# EAGLE design durtest-ripup (EAGLE 6.0)
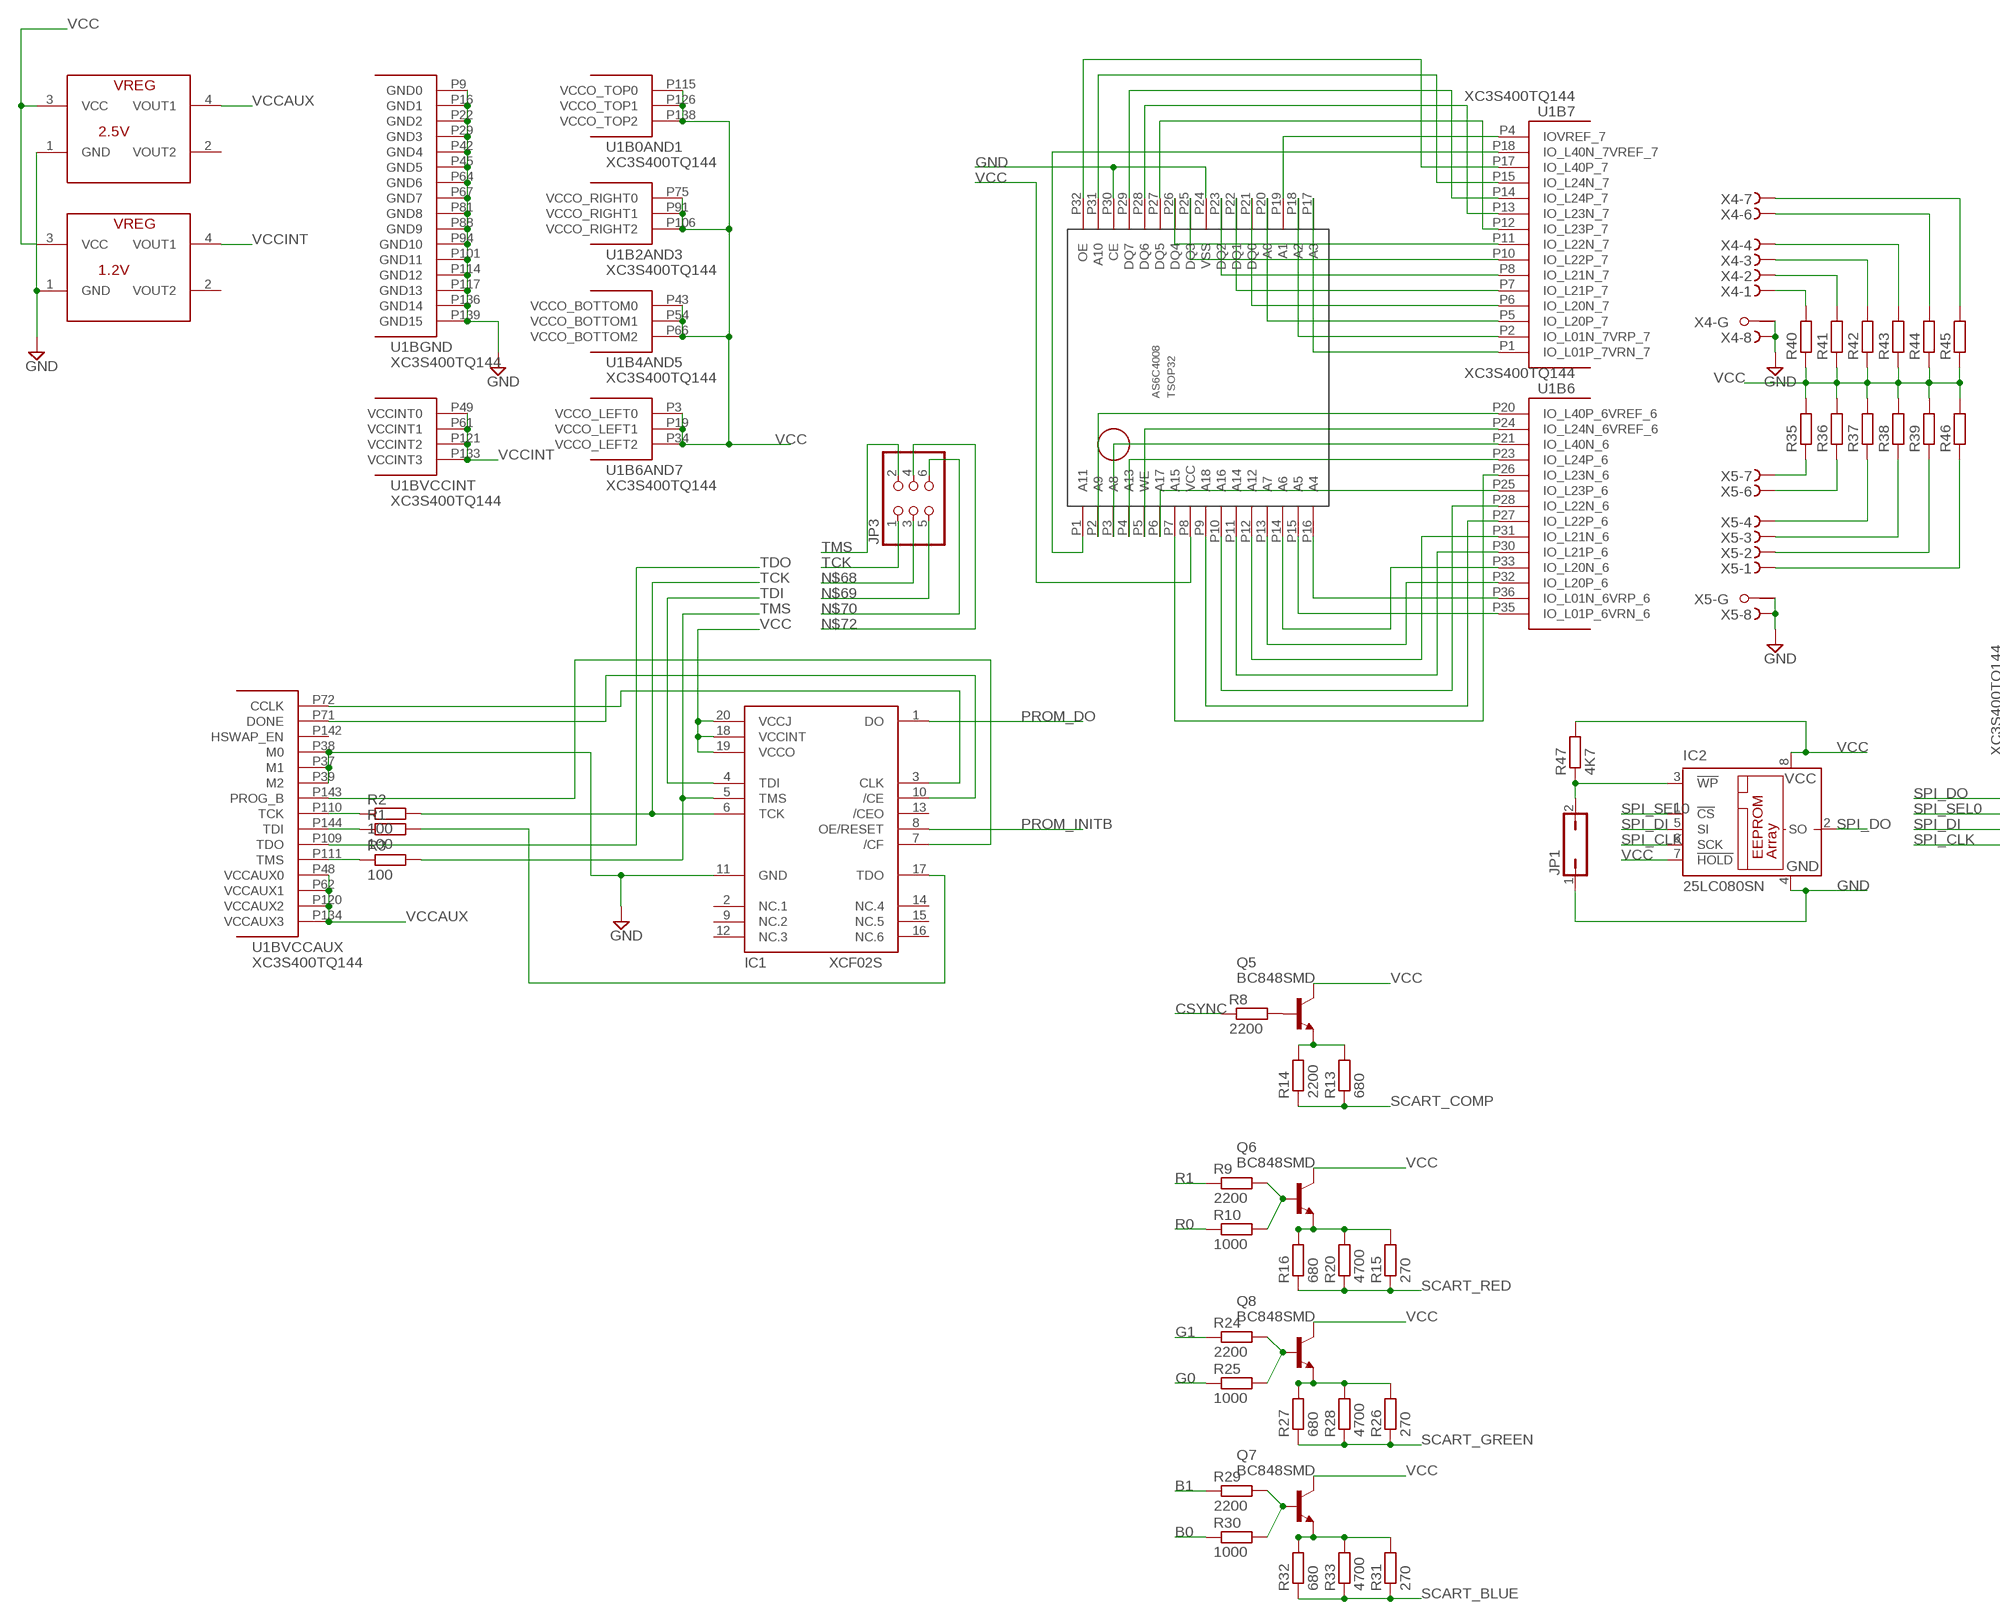
[diagram p0: schematic, sheet 1, part 1 of 2]
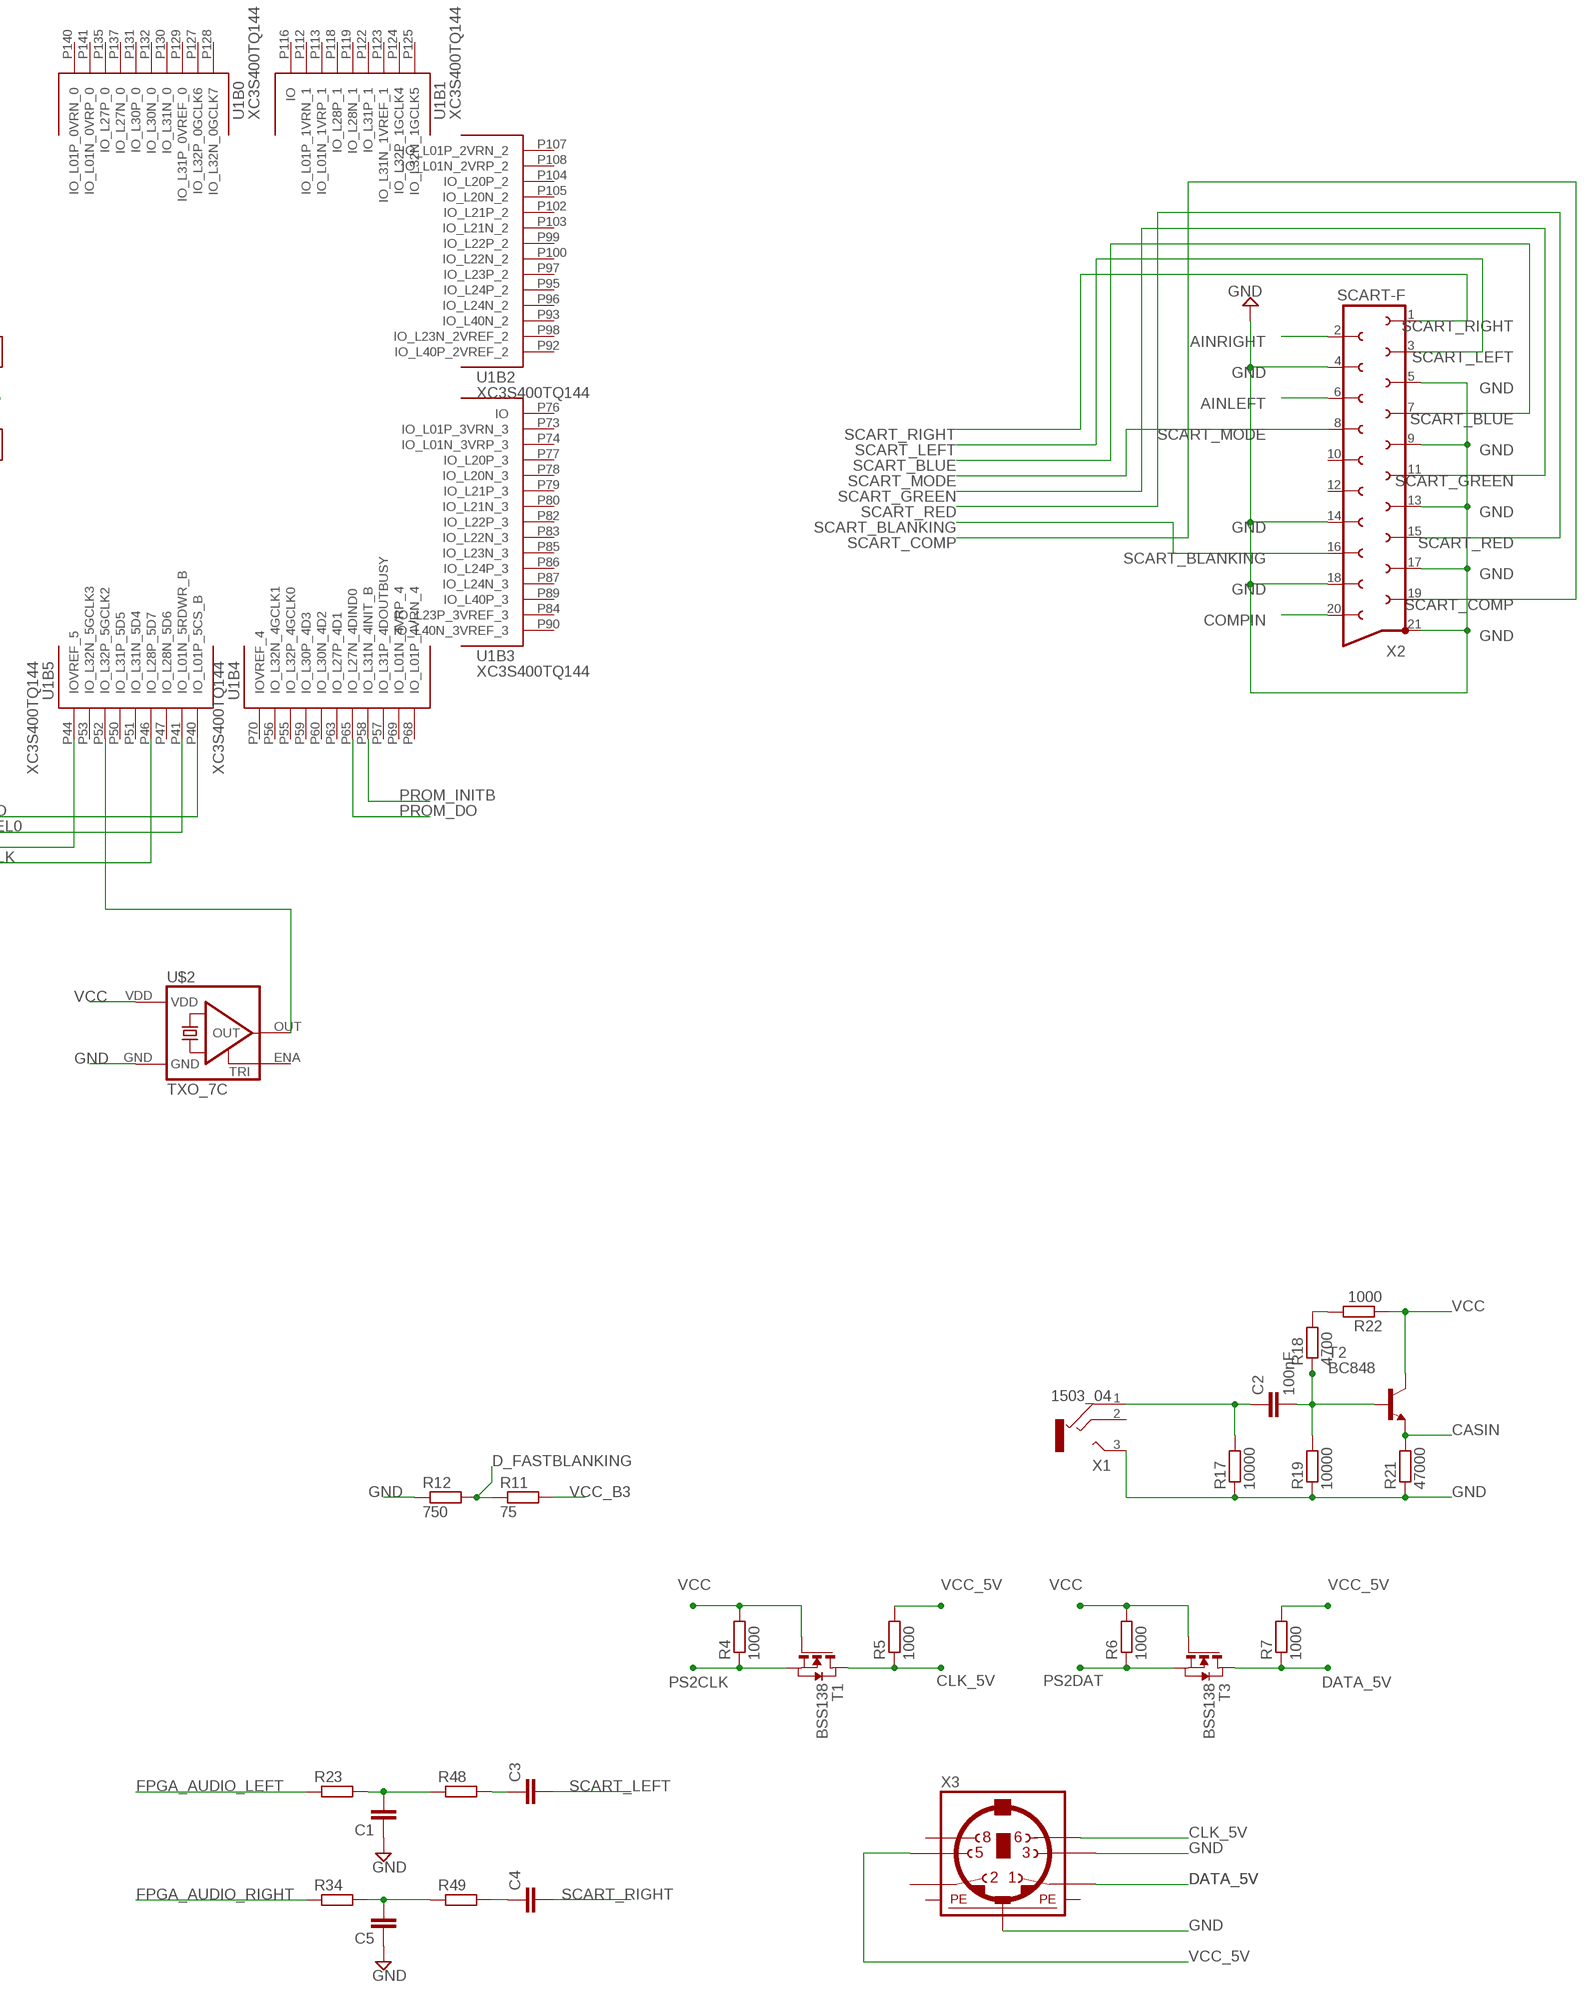
[diagram p1: schematic, sheet 1, part 2 of 2]

## Parts
C1  C-EUC0603  [C0603]
C2  100nF  C-EUC0603  [C0603]
C3  C-EUC0603  [C0603]
C4  C-EUC0603  [C0603]
C5  C-EUC0603  [C0603]
IC1  XCF02S  [VO20]
IC2  25LC080SN  [SO-08]
JP1  JP1Q  [JP1]
JP3  PINHD-2X3  [2X03]
Q5  BC848SMD  [SOT23]
Q6  BC848SMD  [SOT23]
Q7  BC848SMD  [SOT23]
Q8  BC848SMD  [SOT23]
R1  100  R-EU_R0805  [R0805]
R2  100  R-EU_R0805  [R0805]
R3  100  R-EU_R0805  [R0805]
R4  1000  R-EU_R0805  [R0805]
R5  1000  R-EU_R0805  [R0805]
R6  1000  R-EU_R0805  [R0805]
R7  1000  R-EU_R0805  [R0805]
R8  2200  R-EU_R0805  [R0805]
R9  2200  R-EU_R0805  [R0805]
R10  1000  R-EU_R0805  [R0805]
R11  75  R-EU_R0805  [R0805]
R12  750  R-EU_R0805  [R0805]
R13  680  R-EU_R0805  [R0805]
R14  2200  R-EU_R0805  [R0805]
R15  270  R-EU_R0805  [R0805]
R16  680  R-EU_R0805  [R0805]
R17  10000  R-EU_R0805  [R0805]
R18  4700  R-EU_R0805  [R0805]
R19  10000  R-EU_R0805  [R0805]
R20  4700  R-EU_R0805  [R0805]
R21  47000  R-EU_R0805  [R0805]
R22  1000  R-EU_R0805  [R0805]
R23  R-EU_M0805  [M0805]
R24  2200  R-EU_R0805  [R0805]
R25  1000  R-EU_R0805  [R0805]
R26  270  R-EU_R0805  [R0805]
R27  680  R-EU_R0805  [R0805]
R28  4700  R-EU_R0805  [R0805]
R29  2200  R-EU_R0805  [R0805]
R30  1000  R-EU_R0805  [R0805]
R31  270  R-EU_R0805  [R0805]
R32  680  R-EU_R0805  [R0805]
R33  4700  R-EU_R0805  [R0805]
R34  R-EU_M0805  [M0805]
R35  R-EU_M0805  [M0805]
R36  R-EU_M0805  [M0805]
R37  R-EU_M0805  [M0805]
R38  R-EU_M0805  [M0805]
R39  R-EU_M0805  [M0805]
R40  R-EU_M0805  [M0805]
R41  R-EU_M0805  [M0805]
R42  R-EU_M0805  [M0805]
R43  R-EU_M0805  [M0805]
R44  R-EU_M0805  [M0805]
R45  R-EU_M0805  [M0805]
R46  R-EU_M0805  [M0805]
R47  4K7  R-EU_R0805  [R0805]
R48  R-EU_M0805  [M0805]
R49  R-EU_M0805  [M0805]
REG1.2  1.2V  NX1117  [SOT223]
REG2.5  2.5V  NX1117  [SOT223]
T1  BSS138  NMOSSOT23  [SOT-23]
T2  BC848  [SOT23]
T3  BSS138  NMOSSOT23  [SOT-23]
U1  XC3S400TQ144  [TQ144]
U$1  AS6C4008  [TSOP32]
U$2  TXO_7C  [OSC_7C]
X1  1503_04  [1503_04]
X2  SCART-F  [SCART-F]
X3  MINI_DIN_6  [M_DIN6]
X4  F09HPS  [F09HP]
X5  F09HPS  [F09HP]

## Nets
AINLEFT: X2.6
AINRIGHT: X2.2
B0: R30.1
B1: R29.1
CASIN: R21.2 T2.2(E)
CLK_5V: R5.1 T1.1(D) X3.6
COMPIN: X2.20
CSYNC: R8.1
D_FASTBLANKING: R11.1 R12.2
DATA_5V: R7.1 T3.1(D) X3.1
FPGA_AUDIO_LEFT: R23.1
FPGA_AUDIO_RIGHT: R34.1
G0: R25.1
G1: R24.1
GND: C1.1 C5.1 IC1.11(GND) IC2.4(GND) JP1.1 R12.1 R17.1 R19.1 R21.1 REG1.2.1(GND) REG2.5.1(GND) U1.P9(BGND:GND0) U1.P16(BGND:GND1) U1.P22(BGND:GND2) U1.P29(BGND:GND3) U1.P37(BVCCAUX:M1) U1.P38(BVCCAUX:M0) U1.P39(BVCCAUX:M2) U1.P42(BGND:GND4) U1.P45(BGND:GND5) U1.P64(BGND:GND6) U1.P67(BGND:GND7) U1.P81(BGND:GND8) U1.P88(BGND:GND9) U1.P94(BGND:GND10) U1.P101(BGND:GND11) U1.P114(BGND:GND12) U1.P117(BGND:GND13) U1.P136(BGND:GND14) U1.P139(BGND:GND15) U$1.P24(VSS) U$1.P30(CE) U$2.GND X1.3 X2.4 X2.5 X2.9 X2.13 X2.14 X2.17 X2.18 X2.21 X3.3 X3.SH2(PE2) X4.8(-8:F) X4.G1(-G:G1) X5.8(-8:F) X5.G1(-G:G1)
N$1: U1.P1(B7:IO_L01P_7VRN_7) U$1.P17(A3)
N$2: U1.P2(B7:IO_L01N_7VRP_7) U$1.P18(A2)
N$3: U1.P4(B7:IOVREF_7) U$1.P19(A1)
N$4: U1.P5(B7:IO_L20P_7) U$1.P20(A0)
N$5: U1.P6(B7:IO_L20N_7) U$1.P21(DQ0)
N$6: U1.P7(B7:IO_L21P_7) U$1.P22(DQ1)
N$7: U1.P8(B7:IO_L21N_7) U$1.P23(DQ2)
N$8: U1.P10(B7:IO_L22P_7) U$1.P25(DQ3)
N$9: U1.P11(B7:IO_L22N_7) U$1.P26(DQ4)
N$10: U1.P12(B7:IO_L23P_7) U$1.P27(DQ5)
N$11: U1.P13(B7:IO_L23N_7) U$1.P28(DQ6)
N$12: U1.P14(B7:IO_L24P_7) U$1.P29(DQ7)
N$13: U1.P15(B7:IO_L24N_7) U$1.P31(A10)
N$14: U1.P17(B7:IO_L40P_7) U$1.P32(OE)
N$15: U1.P18(B7:IO_L40N_7VREF_7) U$1.P1(A11)
N$16: U1.P20(B6:IO_L40P_6VREF_6) U$1.P2(A9)
N$17: U1.P21(B6:IO_L40N_6) U$1.P3(A8)
N$18: U1.P23(B6:IO_L24P_6) U$1.P4(A13)
N$19: U1.P24(B6:IO_L24N_6VREF_6) U$1.P5(WE)
N$20: U1.P25(B6:IO_L23P_6) U$1.P6(A17)
N$21: U1.P26(B6:IO_L23N_6) U$1.P7(A15)
N$22: U1.P27(B6:IO_L22P_6) U$1.P9(A18)
N$23: U1.P28(B6:IO_L22N_6) U$1.P10(A16)
N$24: U1.P30(B6:IO_L21P_6) U$1.P11(A14)
N$25: U1.P31(B6:IO_L21N_6) U$1.P12(A12)
N$26: U1.P32(B6:IO_L20P_6) U$1.P13(A7)
N$27: U1.P33(B6:IO_L20N_6) U$1.P14(A6)
N$28: U1.P35(B6:IO_L01P_6VRN_6) U$1.P15(A5)
N$29: U1.P36(B6:IO_L01N_6VRP_6) U$1.P16(A4)
N$30: R35.1 X5.7(-7:F)
N$31: R36.1 X5.6(-6:F)
N$32: R37.1 X5.4(-4:F)
N$33: R38.1 X5.3(-3:F)
N$34: R39.1 X5.2(-2:F)
N$35: IC1.3(CLK) U1.P72(BVCCAUX:CCLK)
N$36: IC1.17(TDO) R1.2
N$37: R46.1 X5.1(-1:F)
N$38: IC1.10(/CE) U1.P71(BVCCAUX:DONE)
N$39: R2.1 U1.P110(BVCCAUX:TCK)
N$40: IC1.7(/CF) U1.P143(BVCCAUX:PROG_B)
N$41: R40.2 X4.1(-1:F)
N$42: R1.1 U1.P144(BVCCAUX:TDI)
N$43: R3.1 U1.P111(BVCCAUX:TMS)
N$44: R41.2 X4.2(-2:F)
N$45: R42.2 X4.3(-3:F)
N$46: R43.2 X4.4(-4:F)
N$47: R44.2 X4.6(-6:F)
N$48: R45.2 X4.7(-7:F)
N$49: IC2.3(!WP) JP1.2 R47.1
N$50: U1.P52(B5:IO_L32P_5GCLK2) U$2.OUT
N$51: C1.2 R23.2 R48.1
N$52: C3.1 R48.2
N$53: Q6.1(B) R9.2 R10.2
N$54: Q6.2(E) R15.2 R16.2 R20.2
N$55: Q8.1(B) R24.2 R25.2
N$56: Q8.2(E) R26.2 R27.2 R28.2
N$57: Q7.1(B) R29.2 R30.2
N$58: Q7.2(E) R31.2 R32.2 R33.2
N$59: Q5.2(E) R13.2 R14.2
N$60: C2.2 R18.1 R19.2 T2.1(B)
N$61: C2.1 R17.2 X1.1
N$62: R18.2 R22.2
N$63: Q5.1(B) R8.2
N$64: C4.1 R49.2
N$65: C5.2 R34.2 R49.1
N$68: JP3.3
N$69: JP3.5
N$70: JP3.6
N$72: JP3.4
PROM_DO: IC1.1(DO) U1.P65(B4:IO_L27N_4DIND0)
PROM_INITB: IC1.8(OE/RESET) U1.P58(B4:IO_L31N_4INIT_B)
PS2CLK: R4.1 T1.2(S)
PS2DAT: R6.1 T3.2(S)
R0: R10.1
R1: R9.1
SCART_BLANKING: X2.16
SCART_BLUE: R31.1 R32.1 R33.1 X2.7
SCART_COMP: R13.1 R14.1 X2.19
SCART_GREEN: R26.1 R27.1 R28.1 X2.11
SCART_LEFT: C3.2 X2.3
SCART_MODE: X2.8
SCART_RED: R15.1 R16.1 R20.1 X2.15
SCART_RIGHT: C4.2 X2.1
SPI_CLK: IC2.6(SCK) U1.P46(B5:IO_L28P_5D7)
SPI_DI: IC2.5(SI) U1.P44(B5:IOVREF_5)
SPI_DO: IC2.2(SO) U1.P40(B5:IO_L01P_5CS_B)
SPI_SEL0: IC2.1(!CS) U1.P41(B5:IO_L01N_5RDWR_B)
TCK: IC1.6(TCK) JP3.1 R2.2
TDI: IC1.4(TDI)
TDO: U1.P109(BVCCAUX:TDO)
TMS: IC1.5(TMS) JP3.2 R3.2
VCC: IC1.18(VCCINT) IC1.19(VCCO) IC1.20(VCCJ) IC2.7(!HOLD) IC2.8(VCC) Q5.3(C) Q6.3(C) Q7.3(C) Q8.3(C) R4.2 R6.2 R22.1 R35.2 R36.2 R37.2 R38.2 R39.2 R40.1 R41.1 R42.1 R43.1 R44.1 R45.1 R46.2 R47.2 REG1.2.3(VCC) REG2.5.3(VCC) T1.3(G) T2.3(C) T3.3(G) U1.P3(B6AND7:VCCO_LEFT0) U1.P19(B6AND7:VCCO_LEFT1) U1.P34(B6AND7:VCCO_LEFT2) U1.P43(B4AND5:VCCO_BOTTOM0) U1.P54(B4AND5:VCCO_BOTTOM1) U1.P66(B4AND5:VCCO_BOTTOM2) U1.P75(B2AND3:VCCO_RIGHT0) U1.P91(B2AND3:VCCO_RIGHT1) U1.P106(B2AND3:VCCO_RIGHT2) U1.P115(B0AND1:VCCO_TOP0) U1.P126(B0AND1:VCCO_TOP1) U1.P138(B0AND1:VCCO_TOP2) U$1.P8(VCC) U$2.VDD
VCC_5V: R5.2 R7.2 X3.5
VCC_B3: R11.2
VCCAUX: REG2.5.4(VOUT1) U1.P48(BVCCAUX:VCCAUX0) U1.P62(BVCCAUX:VCCAUX1) U1.P120(BVCCAUX:VCCAUX2) U1.P134(BVCCAUX:VCCAUX3)
VCCINT: REG1.2.4(VOUT1) U1.P49(BVCCINT:VCCINT0) U1.P61(BVCCINT:VCCINT1) U1.P121(BVCCINT:VCCINT2) U1.P133(BVCCINT:VCCINT3)
Unconnected: IC1.2(NC.1) IC1.9(NC.2) IC1.12(NC.3) IC1.13(/CEO) IC1.14(NC.4) IC1.15(NC.5) IC1.16(NC.6) REG1.2.2(VOUT2) REG2.5.2(VOUT2) U1.P47(B5:IO_L28N_5D6) U1.P50(B5:IO_L31P_5D5) U1.P51(B5:IO_L31N_5D4) U1.P53(B5:IO_L32N_5GCLK3) U1.P55(B4:IO_L32P_4GCLK0) U1.P56(B4:IO_L32N_4GCLK1) U1.P57(B4:IO_L31P_4DOUTBUSY) U1.P59(B4:IO_L30P_4D3) U1.P60(B4:IO_L30N_4D2) U1.P63(B4:IO_L27P_4D1) U1.P68(B4:IO_L01P_4VRN_4) U1.P69(B4:IO_L01N_4VRP_4) U1.P70(B4:IOVREF_4) U1.P73(B3:IO_L01P_3VRN_3) U1.P74(B3:IO_L01N_3VRP_3) U1.P76(B3:IO) U1.P77(B3:IO_L20P_3) U1.P78(B3:IO_L20N_3) U1.P79(B3:IO_L21P_3) U1.P80(B3:IO_L21N_3) U1.P82(B3:IO_L22P_3) U1.P83(B3:IO_L22N_3) U1.P84(B3:IO_L23P_3VREF_3) U1.P85(B3:IO_L23N_3) U1.P86(B3:IO_L24P_3) U1.P87(B3:IO_L24N_3) U1.P89(B3:IO_L40P_3) U1.P90(B3:IO_L40N_3VREF_3) U1.P92(B2:IO_L40P_2VREF_2) U1.P93(B2:IO_L40N_2) U1.P95(B2:IO_L24P_2) U1.P96(B2:IO_L24N_2) U1.P97(B2:IO_L23P_2) U1.P98(B2:IO_L23N_2VREF_2) U1.P99(B2:IO_L22P_2) U1.P100(B2:IO_L22N_2) U1.P102(B2:IO_L21P_2) U1.P103(B2:IO_L21N_2) U1.P104(B2:IO_L20P_2) U1.P105(B2:IO_L20N_2) U1.P107(B2:IO_L01P_2VRN_2) U1.P108(B2:IO_L01N_2VRP_2) U1.P112(B1:IO_L01P_1VRN_1) U1.P113(B1:IO_L01N_1VRP_1) U1.P116(B1:IO) U1.P118(B1:IO_L28P_1) U1.P119(B1:IO_L28N_1) U1.P122(B1:IO_L31P_1) U1.P123(B1:IO_L31N_1VREF_1) U1.P124(B1:IO_L32P_1GCLK4) U1.P125(B1:IO_L32N_1GCLK5) U1.P127(B0:IO_L32P_0GCLK6) U1.P128(B0:IO_L32N_0GCLK7) U1.P129(B0:IO_L31P_0VREF_0) U1.P130(B0:IO_L31N_0) U1.P131(B0:IO_L30P_0) U1.P132(B0:IO_L30N_0) U1.P135(B0:IO_L27P_0) U1.P137(B0:IO_L27N_0) U1.P140(B0:IO_L01P_0VRN_0) U1.P141(B0:IO_L01N_0VRP_0) U1.P142(BVCCAUX:HSWAP_EN) U$2.ENA(TRI) X1.2 X2.10 X2.12 X3.2 X3.8 X4.5(-5:F) X4.9(-9:F) X4.G2(-G:G2) X5.5(-5:F) X5.9(-9:F) X5.G2(-G:G2)

## Power pins joined to a net without a drawn wire
PE1: X3.SH1(PE1)
PE3: X3.SH3(PE3)

## Library data of the parts
C1-C5 = resistor:C-EU: CAPACITOR, European symbol
IC1 = smd-special:XCF02S
IC2 = microchip:25*: Serial EEPROM 4K/ 8K , SPI bus; MF: MICROCHIP; MPN: 25LC080/SN; OC_FARNELL: 1137302; OC_NEWARK: 96K4092
JP1 = jumper:JP1Q: JUMPER
JP3 = pinhead:PINHD-2X3: PIN HEADER
Q5-Q8 = bc548:BC848*: NPN Transistor
R1-R22 R24-R33 R47 = rcl:R-EU_: RESISTOR, European symbol
R23 R34-R46 R48 R49 = resistor:R-EU_: RESISTOR, European symbol
REG1.2 REG2.5 = cpcfpga:NX1117
T1 T3 = zetex:NMOSSOT23: MOS FET; OC_FARNELL: unknown; OC_NEWARK: unknown
T2 = transistor:BC848: NPN TRANSISTOR
U1 = xilinx_spartan3_virtex4_and_5:XC3S400TQ144: Xilinx FPGA
U$1 = cpcfpga:AS6C4008
U$2 = cpcfpga:TXO_7C: TXC crystal oscillator http://www.txccrystal.com/images/pdf/7c.pdf
X1 = con-lumberg:1503_04: Jack connectors according to JISC 6560, 3.5 mm, IP 57 Klinkensteckverbinder nach JISC 6560, 3,5 mm, IP 57 Source: http://www.lumberg.com/Produkte/PDFs/1503_04.pdf; OC_FARNELL: 1216981; OC_NEWARK: unknown
X2 = con-hirschmann:SCART-F: TV SCART CONNECTOR; OC_FARNELL: unknown; OC_NEWARK: unknown
X3 = mini_din:MINI_DIN_6
X4 X5 = con-subd:F09HPS: SUB-D; OC_FARNELL: unknown; OC_NEWARK: unknown

## Net classes
1 power: width 0.6 mm, drill 1.1 mm, clearance 0.4 mm

## Board
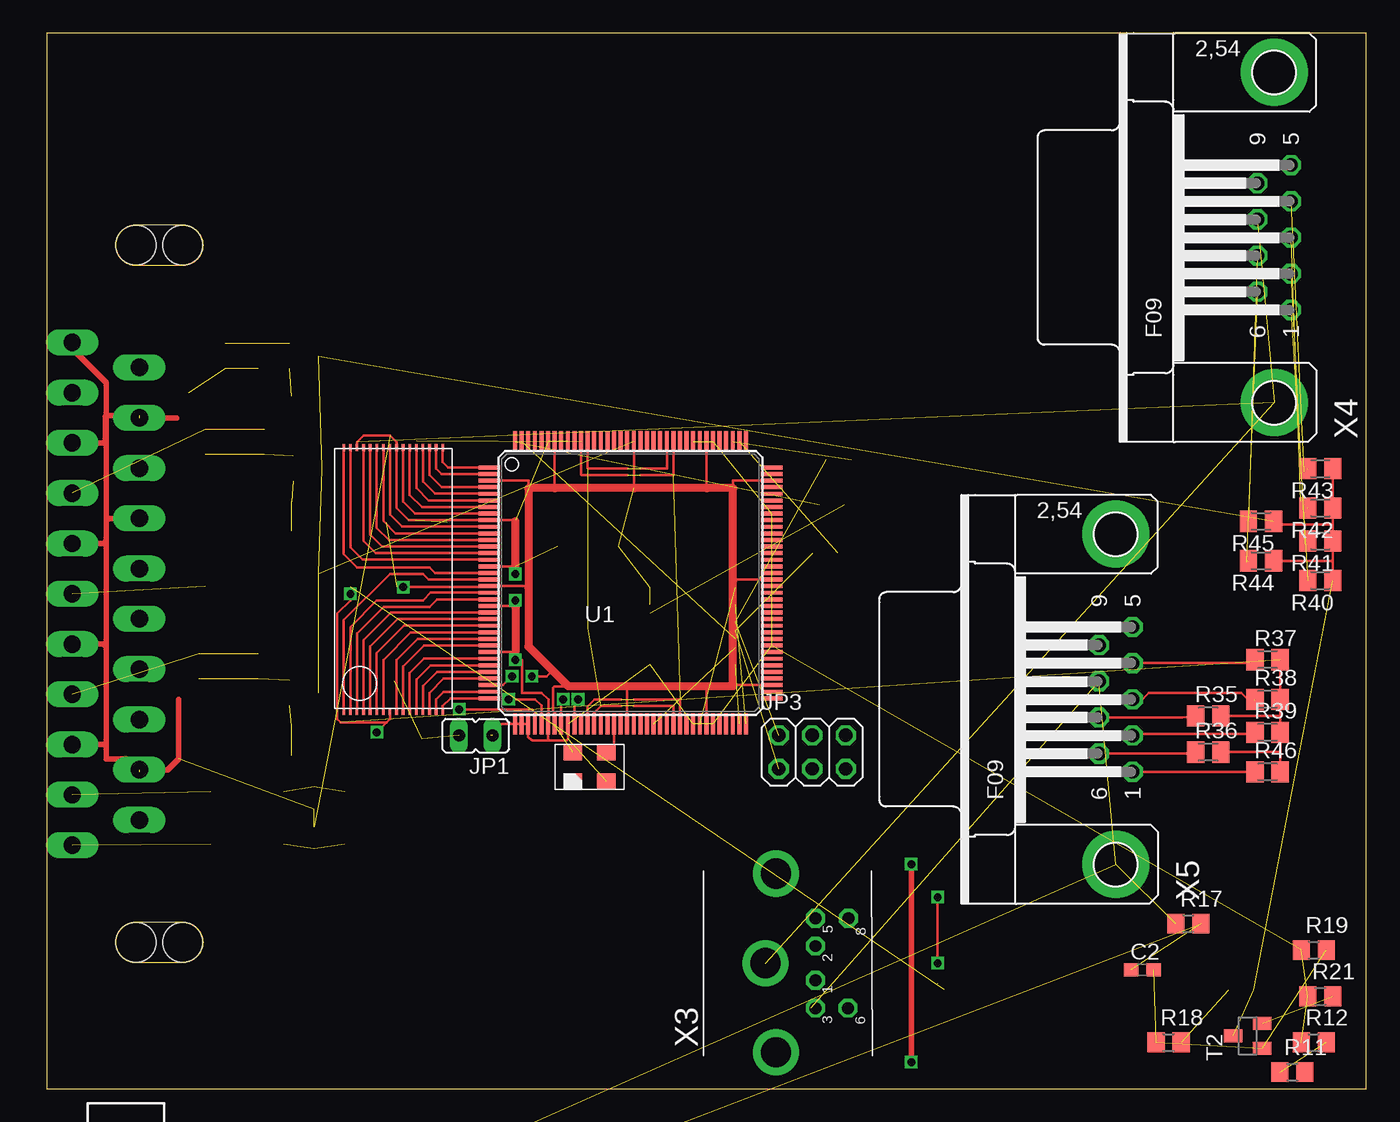
[diagram p2: board, top side]
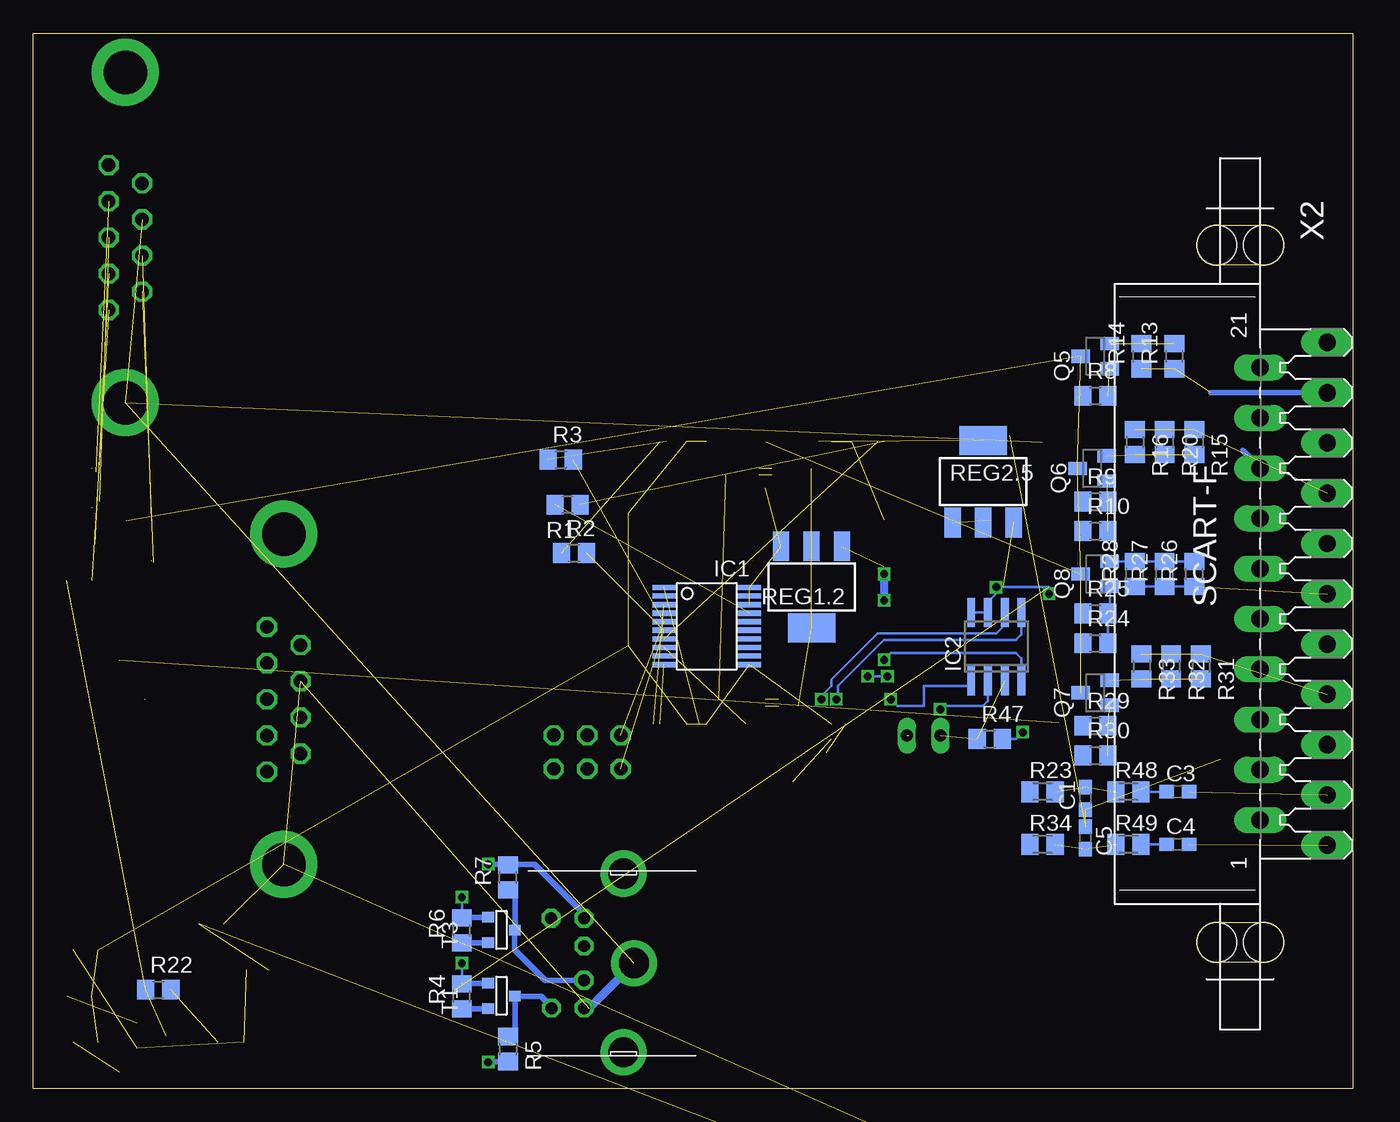
[diagram p3: board, bottom side, seen from below]

Size 100 x 80 mm. Coordinates in mm from the lower left corner, seen from the top.
Outline: 0,0 100,0 100,80 0,80 0,0
Copper layers (1*16): Top 0.0356mm / dielectric 1.5011mm / Bottom 0.0356mm
Design rules: minimum track width 6mil, minimum drill 13mil, track to track 6mil, track to pad 6mil, pad to pad 6mil, via to via 6mil, smd to smd 6mil, copper to edge 15mil, drill to drill 6mil, minimum pad ring 7mil, minimum via ring 7mil, stop-mask expansion 4mil, vias tented up to drill 0mil, thermal gap 10mil

### Footprints (pad centres in the part's own frame; a part is rotated, then mirrored left to right if it is on the bottom)
C0603 = smd 1.1 x 1: 1 -0.85,0; 2 0.85,0
VO20 = smd 0.4 x 1.8: 1 5.85,6.15; 2 5.2,6.15; 3 4.55,6.15; 4 3.9,6.15; 5 3.25,6.15; 6 2.6,6.15; 7 1.95,6.15; 8 1.3,6.15; 9 0.65,6.15; 10 0,6.15; 11 0,-0.3; 12 0.65,-0.3; 13 1.3,-0.3; 14 1.95,-0.3; 15 2.6,-0.3; 16 3.25,-0.3; 17 3.9,-0.3; 18 4.55,-0.3; 19 5.2,-0.3; 20 5.85,-0.3
SO-08 = smd 0.6 x 2.2: 1 -1.905,-2.6; 2 -0.635,-2.6; 3 0.635,-2.6; 4 1.905,-2.6; 5 1.905,2.6; 6 0.635,2.6; 7 -0.635,2.6; 8 -1.905,2.6
JP1 = drill 0.914 long: 1 0,-1.27; 2 0,1.27
2X03 = drill 1.016 octagon: 1 -2.54,-1.27; 2 -2.54,1.27; 3 0,-1.27; 4 0,1.27; 5 2.54,-1.27; 6 2.54,1.27
SOT23 = smd 1 x 1.4: 1 -0.95,-1.1; 2 0.95,-1.1; 3 0,1.1
R0805 = smd 1.3 x 1.5: 1 -0.95,0; 2 0.95,0
M0805 = smd 1.3 x 1.6: 1 -0.95,0; 2 0.95,0
SOT223 = smd 1.219 x 2.235: 1 -2.311,-3.099; 2 0,-3.099; 3 2.311,-3.099 | smd 3.6 x 2.2: 4 0,3.099
SOT-23 = smd 0.787 x 0.889: 1 0.025,-1.016; 2 -0.94,1.016; 3 0.991,1.016
TQ144 = smd 1.6 x 0.3: P1 -10.7,8.75; P2 -10.7,8.25; P3 -10.7,7.75; P4 -10.7,7.25; P5 -10.7,6.75; P6 -10.7,6.25; P7 -10.7,5.75; P8 -10.7,5.25; P9 -10.7,4.75; P10 -10.7,4.25; P11 -10.7,3.75; P12 -10.7,3.25; P13 -10.7,2.75; P14 -10.7,2.25; P15 -10.7,1.75; P16 -10.7,1.25; P17 -10.7,0.75; P18 -10.7,0.25; P19 -10.7,-0.25; P20 -10.7,-0.75; P21 -10.7,-1.25; P22 -10.7,-1.75; P23 -10.7,-2.25; P24 -10.7,-2.75; P25 -10.7,-3.25; P26 -10.7,-3.75; P27 -10.7,-4.25; P28 -10.7,-4.75; P29 -10.7,-5.25; P30 -10.7,-5.75; P31 -10.7,-6.25; P32 -10.7,-6.75; P33 -10.7,-7.25; P34 -10.7,-7.75; P35 -10.7,-8.25; P36 -10.7,-8.75; P73 10.7,-8.75; P74 10.7,-8.25; P75 10.7,-7.75; P76 10.7,-7.25; P77 10.7,-6.75; P78 10.7,-6.25; P79 10.7,-5.75; P80 10.7,-5.25; P81 10.7,-4.75; P82 10.7,-4.25; P83 10.7,-3.75; P84 10.7,-3.25; P85 10.7,-2.75; P86 10.7,-2.25; P87 10.7,-1.75; P88 10.7,-1.25; P89 10.7,-0.75; P90 10.7,-0.25; P91 10.7,0.25; P92 10.7,0.75; P93 10.7,1.25; P94 10.7,1.75; P95 10.7,2.25; P96 10.7,2.75; P97 10.7,3.25; P98 10.7,3.75; P99 10.7,4.25; P100 10.7,4.75; P101 10.7,5.25; P102 10.7,5.75; P103 10.7,6.25; P104 10.7,6.75; P105 10.7,7.25; P106 10.7,7.75; P107 10.7,8.25; P108 10.7,8.75 | smd 0.3 x 1.6: P37 -8.75,-10.7; P38 -8.25,-10.7; P39 -7.75,-10.7; P40 -7.25,-10.7; P41 -6.75,-10.7; P42 -6.25,-10.7; P43 -5.75,-10.7; P44 -5.25,-10.7; P45 -4.75,-10.7; P46 -4.25,-10.7; P47 -3.75,-10.7; P48 -3.25,-10.7; P49 -2.75,-10.7; P50 -2.25,-10.7; P51 -1.75,-10.7; P52 -1.25,-10.7; P53 -0.75,-10.7; P54 -0.25,-10.7; P55 0.25,-10.7; P56 0.75,-10.7; P57 1.25,-10.7; P58 1.75,-10.7; P59 2.25,-10.7; P60 2.75,-10.7; P61 3.25,-10.7; P62 3.75,-10.7; P63 4.25,-10.7; P64 4.75,-10.7; P65 5.25,-10.7; P66 5.75,-10.7; P67 6.25,-10.7; P68 6.75,-10.7; P69 7.25,-10.7; P70 7.75,-10.7; P71 8.25,-10.7; P72 8.75,-10.7; P109 8.75,10.7; P110 8.25,10.7; P111 7.75,10.7; P112 7.25,10.7; P113 6.75,10.7; P114 6.25,10.7; P115 5.75,10.7; P116 5.25,10.7; P117 4.75,10.7; P118 4.25,10.7; P119 3.75,10.7; P120 3.25,10.7; P121 2.75,10.7; P122 2.25,10.7; P123 1.75,10.7; P124 1.25,10.7; P125 0.75,10.7; P126 0.25,10.7; P127 -0.25,10.7; P128 -0.75,10.7; P129 -1.25,10.7; P130 -1.75,10.7; P131 -2.25,10.7; P132 -2.75,10.7; P133 -3.25,10.7; P134 -3.75,10.7; P135 -4.25,10.7; P136 -4.75,10.7; P137 -5.25,10.7; P138 -5.75,10.7; P139 -6.25,10.7; P140 -6.75,10.7; P141 -7.25,10.7; P142 -7.75,10.7; P143 -8.25,10.7; P144 -8.75,10.7
TSOP32 = smd 0.5 x 0.2: P1 -9.75,3.75; P2 -9.75,3.25; P3 -9.75,2.75; P4 -9.75,2.25; P5 -9.75,1.75; P6 -9.75,1.25; P7 -9.75,0.75; P8 -9.75,0.25; P9 -9.75,-0.25; P10 -9.75,-0.75; P11 -9.75,-1.25; P12 -9.75,-1.75; P13 -9.75,-2.25; P14 -9.75,-2.75; P15 -9.75,-3.25; P16 -9.75,-3.75; P17 10.25,-3.75; P18 10.25,-3.25; P19 10.25,-2.75; P20 10.25,-2.25; P21 10.25,-1.75; P22 10.25,-1.25; P23 10.25,-0.75; P24 10.25,-0.25; P25 10.25,0.25; P26 10.25,0.75; P27 10.25,1.25; P28 10.25,1.75; P29 10.25,2.25; P30 10.25,2.75; P31 10.25,3.25; P32 10.25,3.75
OSC_7C = smd 1.4 x 1.2: ENA -1.27,-1.1; GND 1.27,-1.1; OUT 1.27,1.1; VDD -1.27,1.1
1503_04 = drill 0.8 pad 1.2 long: 1 3.9,-10.25; 2 0.65,-10.25 | drill 1 pad 1.2 long: 3 -2.3,-10.25 | hole 1.6: 0,0
SCART-F = drill 1.321 long: 1 19.05,5.08; 2 17.145,0; 3 15.24,5.08; 4 13.335,0; 5 11.43,5.08; 6 9.525,0; 7 7.62,5.08; 8 5.715,0; 9 3.81,5.08; 10 1.905,0; 11 0,5.08; 12 -1.905,0; 13 -3.81,5.08; 14 -5.715,0; 15 -7.62,5.08; 16 -9.525,0; 17 -11.43,5.08; 18 -13.335,0; 19 -15.24,5.08; 20 -17.145,0; 21 -19.05,5.08 | hole 3.023: 26.416,0.254; 26.416,-3.302; -26.416,0.254; -26.416,-3.302
M_DIN6 = drill 0.9 pad 1.422 octagon: 1 -1.3,-3.75; 2 1.3,-3.75; 3 -3.4,-3.75; 5 3.4,-3.75; 6 -3.4,-6.2; 8 3.4,-6.25 | drill 2.3 pad 3.5: SH1 6.8,-0.75; SH2 0,0.05; SH3 -6.75,-0.75
F09HP = drill 1.016 octagon: 1 -5.486,-1.27; 2 -2.743,-1.27; 3 0,-1.27; 4 2.743,-1.27; 5 5.486,-1.27; 6 -4.115,1.27; 7 -1.372,1.27; 8 1.372,1.27; 9 4.115,1.27 | drill 3.302 pad 5.08: G1 -12.522,0; G2 12.522,0

### Placement (x,y rotation side)
C1  20.25,22 90 bottom
C2  83,9 0 top
C3  13.25,22.5 0 bottom
C4  13.25,18.5 0 bottom
C5  20.25,19 270 bottom
IC1  46.02,32.13 90 bottom
IC2  27,33.5 0 bottom
JP1  32.5,26.75 90 top
JP3  58,25.5 0 top
Q5  19.5,55.5 90 bottom
Q6  19.75,47 90 bottom
Q7  19.5,30 90 bottom
Q8  19.5,39 90 bottom
R1  59.49,44.25 180 bottom
R2  59,40.58 0 bottom
R3  60.01,47.68 0 bottom
R4  67.5,7 90 bottom
R5  64,3 270 bottom
R6  67.5,12 90 bottom
R7  64,16 90 bottom
R8  19.5,52.5 0 bottom
R9  19.5,44.5 0 bottom
R10  19.5,42.25 0 bottom
R11  94.38,1.25 0 top
R12  96,3.5 0 top
R13  13.5,55.5 90 bottom
R14  16,55.5 90 bottom
R15  12,49 270 bottom
R16  16.5,49 270 bottom
R17  86.5,12.5 0 top
R18  85,3.5 0 top
R19  96,10.5 0 top
R20  14.25,49 270 bottom
R21  96.5,7 0 top
R22  90.5,7.5 0 bottom
R23  23.5,22.5 0 bottom
R24  19.5,33.75 0 bottom
R25  19.5,36 0 bottom
R26  12,39 90 bottom
R27  14.25,39 90 bottom
R28  16.5,39 90 bottom
R29  19.5,27.5 0 bottom
R30  19.5,25.25 0 bottom
R31  11.5,32 270 bottom
R32  13.75,32 270 bottom
R33  16,32 270 bottom
R34  23.5,18.5 0 bottom
R35  88,28.25 0 top
R36  88,25.5 0 top
R37  92.5,32.5 0 top
R38  92.5,29.5 0 top
R39  92.5,27 0 top
R40  96.5,38.5 180 top
R41  96.5,41.5 180 top
R42  96.5,44 180 top
R43  96.5,47 180 top
R44  92,40 180 top
R45  92,43 180 top
R46  92.5,24 0 top
R47  27.5,26.5 0 bottom
R48  17,22.5 0 bottom
R49  17,18.5 0 bottom
REG1.2  41,38 180 bottom
REG2.5  28,46 0 bottom
T1  64.5,7 90 bottom
T2  91,4 90 top
T3  64.5,12 90 bottom
U1  44.23,38.33 0 top
U$1  26.25,38.33 90 top
U$2  41.12,24.38 0 top
X1  6,-7 0 top  (outside the outline)
X2  7,37.5 270 bottom
X3  54.5,9.5 90 top
X4  93,64.5 90 top
X5  81,29.5 90 top

### Tracks (layer width: path | path; a pad name or v marks a point on that pad's centre or on a via)
CASIN  (1 unrouted)
CLK_5V
  Bottom 0.3: 63.48,4.47 R5.1
  Bottom 0.4: X3.6 60.7,6.2 61.5,7 63.46,7 T1.1 63.48,4.47
D_FASTBLANKING  (1 unrouted)
DATA_5V
  Bottom 0.4: R7.1 63.48,14.53 T3.1 63.5,12.01 63.5,10.5 61.2,8.2 X3.1
GND  (via drill 0.6)  (30 unrouted)
  Top 0.2: U$1.P30 23.5,49 24,49.5 26,49.5 26.5,49 U$1.P24 26.5,44 27.42,43.08 U1.P9 35.5,43.08 35.5,43 | U1.P16 35.5,39.58 35.5,39.5 | U1.P22 35.5,36.58 35.5,36.5 | U1.P29 35.5,33.08 | 38,26.38 36.75,26.38 36.48,26.65 U1.P39 U1.P38 U1.P37 34.51,27.63 33.62,26.75 | 38,26.38 39.38,26.38 39.5,26.5 39.5,27.61 U1.P45 | 38,26.38 37.98,26.4 U1.P42 38,27.66 38,29.5 37.5,30 36,30 36,32.5 35.5,33
  Top 0.406: X2.18 9.84,50.84 | X2.4 9.16,24.16 10,25 10,29.5 | X2.21 1.92,56.08 4.5,53.5 4.5,51 | 4.5,51 4.5,49 | 4.5,49 4.5,43 | 4.5,43 4.5,41.5 | 4.5,41.5 4.5,33.5 | 4.5,33.5 4.5,26 | 4.5,26 4.5,25 6,25 7,24 | 4.5,49 4.43,48.93 4.43,49 | X2.14 4.71,43.22 4.5,43 | X2.13 4.31,41.31 4.5,41.5 | X2.9 4.31,33.69 4.5,33.5 | 4.43,49 4.43,50.93 4.5,51 | 4.5,51 7,51 | X2.17 4.36,48.93 4.43,49 | X2.5 4.43,26.07 4.5,26
  Top 0.6: 35.5,39.5 v35.5,39 | v35.5,37 35.5,36.5 35.5,33.08 35.5,33 v35.5,32.5 | 35.5,39.58 35.5,43
  Bottom 0.2: IC2.4 25.09,32.59 25.5,33 35,33 v35.5,32.5
  Bottom 0.6: v35.5,39 v35.5,37 | X3.3 57.85,6.1 X3.SH2
N$1
  Top 0.2: U1.P1 30.42,47.08 30,47.5 U$1.P17
N$2
  Top 0.2: U1.P2 29.92,46.58 29.5,47 U$1.P18
N$3
  Top 0.2: U1.P4 29.92,45.58 29,46.5 U$1.P19
N$4
  Top 0.2: U1.P5 29.42,45.08 28.5,46 U$1.P20
N$5
  Top 0.2: U1.P6 28.92,44.58 28,45.5 U$1.P21
N$6
  Top 0.2: U1.P7 28.42,44.08 27.5,45 U$1.P22
N$7
  Top 0.2: U1.P8 27.92,43.58 27,44.5 U$1.P23
N$8
  Top 0.2: U1.P10 26.92,42.58 26,43.5 U$1.P25
N$9
  Top 0.2: U1.P11 26.42,42.08 25.5,43 U$1.P26
N$10
  Top 0.2: U1.P12 25.92,41.58 25,42.5 U$1.P27
N$11
  Top 0.2: U1.P13 25.42,41.08 24.5,42 U$1.P28
N$12
  Top 0.2: U1.P14 24.92,40.58 24,41.5 U$1.P29
N$13
  Top 0.2: U1.P15 23.92,40.08 23,41 U$1.P31
N$14
  Top 0.2: U1.P17 29.42,39.08 29,39.5 23.5,39.5 22.5,40.5 U$1.P32
N$15
  Top 0.2: U$1.P1 22.5,35.5 26,39 28.5,39 28.92,38.58 U1.P18
N$16
  Top 0.2: U$1.P2 23,35 25,37 28.5,37 29.08,37.58 U1.P20
N$17
  Top 0.2: U$1.P3 23.5,34.5 25.5,36.5 29,36.5 29.58,37.08 U1.P21
N$18
  Top 0.2: U1.P23 26.08,36.08 24,34 U$1.P4
N$19
  Top 0.2: U1.P24 26.58,35.58 24.5,33.5 U$1.P5
N$20
  Top 0.2: U1.P25 27.08,35.08 25,33 U$1.P6
N$21
  Top 0.2: U1.P26 27.58,34.58 25.5,32.5 U$1.P7
N$22
  Top 0.2: U1.P27 28.08,34.08 26.5,32.5 U$1.P9
N$23
  Top 0.2: U1.P28 28.58,33.58 27,32 U$1.P10
N$24
  Top 0.2: U1.P30 28.58,32.58 27.5,31.5 U$1.P11
N$25
  Top 0.2: U1.P31 29.08,32.08 28,31 U$1.P12
N$26
  Top 0.2: U1.P32 29.58,31.58 28.5,30.5 U$1.P13
N$27
  Top 0.2: U$1.P14 29,30 30.08,31.08 U1.P33
N$28
  Top 0.2: U1.P35 30.08,30.08 29.5,29.5 U$1.P15
N$29
  Top 0.2: U1.P36 30.58,29.58 30,29 U$1.P16 30,28.5
N$30
  Top 0.2: X5.7 86.05,28.13 R35.1
N$31
  Top 0.2: X5.6 86.55,25.39 R36.1
N$32
  Top 0.2: X5.4 91.55,32.24 R37.1
N$33  (1 unrouted)
  Top 0.2: X5.3 83,29.5 83.5,30 90.5,30 91,29.5 91.5,29.5
N$34
  Top 0.2: X5.2 82.38,26.76 82.38,26.88 91.55,26.88 R39.1
N$35  (1 unrouted)
N$36  (1 unrouted)
N$37
  Top 0.2: X5.1 91.55,24.01 R46.1
N$38  (1 unrouted)
N$39  (1 unrouted)
N$40  (1 unrouted)
N$41  (1 unrouted)
  Top 0.2: 95.54,38.51 R40.2
N$42  (1 unrouted)
N$43  (1 unrouted)
N$44  (1 unrouted)
  Top 0.2: 95.31,41.26 R41.2
N$45  (2 unrouted)
  Top 0.2: 95,44.5 95.5,44
N$46  (2 unrouted)
  Top 0.2: 95.24,46.74 95.5,47
N$47  (2 unrouted)
  Top 0.2: 90.89,39.88 91,40
N$48  (1 unrouted)
N$49  (2 unrouted)
N$50
  Top 0.2: U1.P52 42.98,26.05 U$2.OUT
N$51  (2 unrouted)
N$52
  Bottom 0.2: R48.2 C3.1
N$53  (2 unrouted)
N$54  (3 unrouted)
N$55
  Bottom 0.2: Q8.1 18.4,36.1 18.5,36 R25.2 R24.2
N$56
  Bottom 0.2: R26.2 R27.2 R28.2 Q8.2
N$57  (2 unrouted)
N$58  (3 unrouted)
N$59  (2 unrouted)
N$60  (3 unrouted)
N$61  (2 unrouted)
N$62  (1 unrouted)
N$63  (1 unrouted)
N$64
  Bottom 0.2: C4.1 R49.2
N$65  (2 unrouted)
PROM_DO  (1 unrouted)
PROM_INITB  (1 unrouted)
PS2CLK
  Bottom 0.4: T1.2 R4.1
PS2DAT
  Bottom 0.4: R6.1 T3.2
SCART_BLANKING
  Bottom 0.406: 8.32,48.35 X2.16
SCART_BLUE  (3 unrouted)
SCART_COMP  (2 unrouted)
  Bottom 0.406: X2.19 10.76,52.74
SCART_GREEN  (1 unrouted)
  Bottom 0.2: R28.1 R27.1 R26.1
SCART_LEFT  (1 unrouted)
SCART_MODE
  Top 0.406: 7.79,31 X2.8
SCART_RED  (3 unrouted)
SCART_RIGHT  (1 unrouted)
SPI_CLK  (via drill 0.6)
  Top 0.2: U1.P46 40,27.66 40,29.25 v40.25,29.5
  Bottom 0.2: IC2.6 26.36,35.13 27,34.5 36,34.5 39.5,31 39.5,30.5 40.25,29.75 v40.25,29.5
SPI_DI  (via drill 0.6)
  Top 0.2: U1.P44 38.98,29.23 v39.12,29.5
  Bottom 0.2: IC2.5 25.09,34.41 25.5,34 35.5,34 39,30.5 39,29.75 v39.12,29.5
SPI_DO  (via drill 0.6)
  Top 0.2: 37,27.63 U1.P40 37,27.66 37,28.5 36.75,28.75 v31.25,28.75
  Bottom 0.2: IC2.2 27.64,29.36 28,29 31,29 v31.25,28.75
SPI_SEL0  (via drill 0.6)
  Top 0.2: U1.P41 37.48,29.02 37,29.5 v35,29.5
  Bottom 0.2: IC2.1 29,30.8 29,30.5 32.5,30.5 32.5,29 34.5,29 v35,29.5
TCK  (2 unrouted)
TMS  (2 unrouted)
VCC  (via drill 0.6)  (17 unrouted)
  Top 0.2: R46.2 93.45,25.5 | 93.45,25.5 R39.2 93.45,28.25 | 93.45,28.25 R38.2 R37.2 | R35.2 93.45,28.25 | R36.2 93.45,25.5 | R40.1 97.45,40 | 97.45,40 R41.1 97.45,42.62 | 97.45,42.62 R42.1 R43.1 | R44.1 97.45,40 | R45.1 93.38,43 93.62,42.75 97.33,42.75 97.45,42.62 | U1.P43 38.5,27.63 | 36.5,38 36.5,38.08 U1.P19 33.45,38 v27,38 | U1.P3 36.5,46.08 36.5,45.5 | v67.5,9.5 v67.5,14.5 | U1.P138 38.48,46.02 38.5,45.5 | U1.P126 44.48,46.02 44.5,45.5 | U1.P54 43.98,30.48 44,30.5 | U1.P66 49.98,30.48 50,30.5 | U1.P75 52,30.58 52,30.5 | U1.P106 52,46.08 52,45.5 | U1.P91 52,38.58 52,38.5 | U1.P115 49.98,46.02 50,45.5 | U$1.P8 26,28 25.75,27.75 | 25.75,27.75 22.25,27.75 22,28 22,36 23,37 v23,37.5 | 25.75,27.75 v25,27 | U1.P34 34.58,30.58 v35.25,31.25 | v36.75,31.25 37.88,31.25 38.31,31.69 | 38.5,27.5 38.5,28.5 38.38,28.62 38.38,30.38 38.48,30.48 39.48,30.48 39.5,30.5
  Top 0.6: 36.5,33.5 38.31,31.69 39.5,30.5 44,30.5 50,30.5 52,30.5 52,38.5 52,45.5 50,45.5 44.5,45.5 38.5,45.5 36.5,45.5 36.5,38 36.5,33.5
  Bottom 0.2: 67.95,7.95 67.95,7.55 68,7.5 | 26.5,38 23,38 v23,37.5 | 26.5,38 v27,38 | 67.49,7.99 v67.49,9.49 v67.5,9.5 | v67.5,14.5 R6.2 | IC2.8 IC2.7 27.64,36.87 26.5,38 | v35.25,31.25 v36.75,31.25 | R47.2 25.5,26.5 v25,27
  Bottom 0.4: T1.3 67.49,7.99 67.5,8 | T3.3 67.46,12.99 R6.2 | R4.2 67.95,7.95 68,8
VCC_5V  (via drill 0.6)
  Top 0.4: v65.5,2 v65.5,17
  Bottom 0.4: X3.5 58.25,13.25 62,17 63.95,17 R7.2 64,17 v65.5,17 | R5.2 65.45,2.05 v65.5,2
VCCAUX  (4 unrouted)
  Top 0.2: U1.P48 40.98,28.98 41.5,29.5 43.5,29.5 | 48,27.66 U1.P62 47.98,29.48 48,29.5 44.5,29.5 | U1.P134 40.48,46.52 40.5,46.5 44,46.5 | U1.P120 47.48,46.52 47.5,46.5 45,46.5
VCCINT  (4 unrouted)
  Top 0.2: U1.P49 41.48,28.48 42,29 43.5,29 | U1.P61 47.48,28.98 47.5,29 44.5,29 | U1.P133 40.98,47.02 41,47 44,47 | U1.P121 46.98,47.02 47,47 45,47